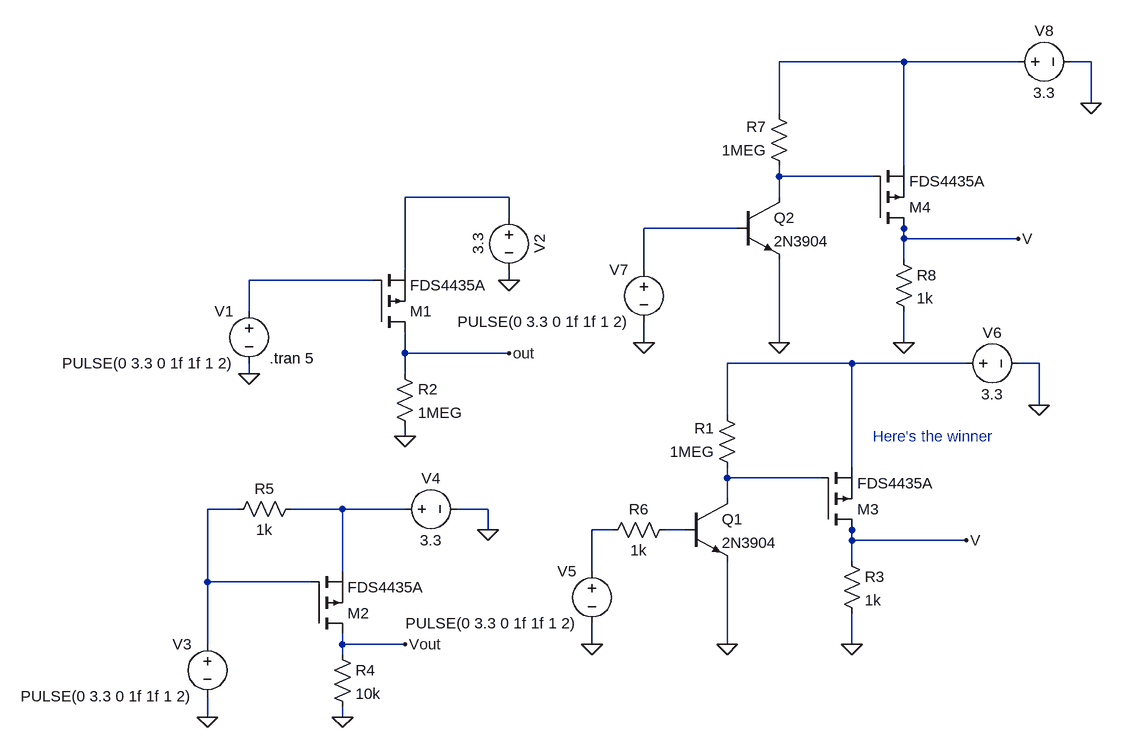
[diagram p0: schematic PMOS switch.asc]
PMOS switch.asc, the LTspice schematic file:
Version 4
SHEET 1 880 680
WIRE -256 -720 -448 -720
WIRE -80 -720 -256 -720
WIRE 32 -720 0 -720
WIRE 32 -656 32 -720
WIRE -448 -640 -448 -720
WIRE -256 -560 -256 -720
WIRE -448 -544 -448 -560
WIRE -304 -544 -448 -544
WIRE -864 -512 -1024 -512
WIRE -448 -512 -448 -544
WIRE -864 -480 -864 -512
WIRE -512 -464 -656 -464
WIRE -256 -464 -256 -480
WIRE -256 -448 -256 -464
WIRE -80 -448 -256 -448
WIRE -256 -416 -256 -448
WIRE -1024 -400 -1024 -512
WIRE -656 -400 -656 -464
WIRE -1072 -384 -1264 -384
WIRE -864 -384 -864 -400
WIRE -1264 -336 -1264 -384
WIRE -656 -288 -656 -320
WIRE -448 -288 -448 -416
WIRE -256 -288 -256 -336
WIRE -1024 -272 -1024 -304
WIRE -864 -272 -1024 -272
WIRE -336 -256 -528 -256
WIRE -160 -256 -336 -256
WIRE -48 -256 -80 -256
WIRE -1264 -240 -1264 -256
WIRE -1024 -240 -1024 -272
WIRE -48 -192 -48 -256
WIRE -528 -176 -528 -256
WIRE -1024 -144 -1024 -160
WIRE -336 -96 -336 -256
WIRE -528 -80 -528 -96
WIRE -384 -80 -528 -80
WIRE -528 -48 -528 -80
WIRE -1280 -32 -1328 -32
WIRE -1120 -32 -1200 -32
WIRE -1024 -32 -1120 -32
WIRE -896 -32 -944 -32
WIRE -896 0 -896 -32
WIRE -704 0 -736 0
WIRE -592 0 -624 0
WIRE -336 0 -336 -16
WIRE -336 16 -336 0
WIRE -160 16 -336 16
WIRE -336 48 -336 16
WIRE -1120 64 -1120 -32
WIRE -736 64 -736 0
WIRE -1328 80 -1328 -32
WIRE -1168 80 -1328 80
WIRE -1328 176 -1328 80
WIRE -1120 176 -1120 160
WIRE -1024 176 -1120 176
WIRE -736 176 -736 144
WIRE -528 176 -528 48
WIRE -336 176 -336 128
WIRE -1120 192 -1120 176
WIRE -1328 288 -1328 256
WIRE -1120 288 -1120 272
FLAG -1264 -240 0
FLAG -1024 -144 0
FLAG -864 -384 0
FLAG -864 -272 out
FLAG -1328 288 0
FLAG -1120 288 0
FLAG -896 0 0
FLAG -1024 176 Vout
FLAG -736 176 0
FLAG -528 176 0
FLAG -336 176 0
FLAG -48 -192 0
FLAG -160 16 V
FLAG -656 -288 0
FLAG -448 -288 0
FLAG -256 -288 0
FLAG 32 -656 0
FLAG -80 -448 V
SYMBOL voltage -1264 -352 M0
WINDOW 123 0 0 Left 2
WINDOW 39 0 0 Left 2
SYMATTR InstName V1
SYMATTR Value PULSE(0 3.3 0 1f 1f 1 2)
SYMBOL voltage -864 -496 R0
WINDOW 0 32 56 VTop 2
WINDOW 3 -32 56 VBottom 2
WINDOW 123 0 0 Left 2
WINDOW 39 0 0 Left 2
SYMATTR InstName V2
SYMATTR Value 3.3
SYMBOL res -1040 -256 R0
SYMATTR InstName R2
SYMATTR Value 1MEG
SYMBOL pmos -1072 -304 M180
SYMATTR InstName M1
SYMATTR Value FDS4435A
SYMBOL voltage -1328 160 M0
WINDOW 123 0 0 Left 2
WINDOW 39 0 0 Left 2
SYMATTR InstName V3
SYMATTR Value PULSE(0 3.3 0 1f 1f 1 2)
SYMBOL pmos -1168 160 M180
SYMATTR InstName M2
SYMATTR Value FDS4435A
SYMBOL voltage -1040 -32 R270
WINDOW 0 32 56 VTop 2
WINDOW 3 -32 56 VBottom 2
WINDOW 123 0 0 Left 2
WINDOW 39 0 0 Left 2
SYMATTR InstName V4
SYMATTR Value 3.3
SYMBOL res -1136 176 R0
SYMATTR InstName R4
SYMATTR Value 10k
SYMBOL res -1296 -16 R270
WINDOW 0 32 56 VTop 2
WINDOW 3 0 56 VBottom 2
SYMATTR InstName R5
SYMATTR Value 1k
SYMBOL voltage -736 48 M0
WINDOW 123 0 0 Left 2
WINDOW 39 0 0 Left 2
SYMATTR InstName V5
SYMATTR Value PULSE(0 3.3 0 1f 1f 1 2)
SYMBOL voltage -176 -256 R270
WINDOW 0 32 56 VTop 2
WINDOW 3 -32 56 VBottom 2
WINDOW 123 0 0 Left 2
WINDOW 39 0 0 Left 2
SYMATTR InstName V6
SYMATTR Value 3.3
SYMBOL npn -592 -48 R0
SYMATTR InstName Q1
SYMATTR Value 2N3904
SYMBOL pmos -384 0 M180
SYMATTR InstName M3
SYMATTR Value FDS4435A
SYMBOL res -512 -80 R180
WINDOW 0 36 76 Left 2
WINDOW 3 36 40 Left 2
SYMATTR InstName R1
SYMATTR Value 1MEG
SYMBOL res -352 32 R0
SYMATTR InstName R3
SYMATTR Value 1k
SYMBOL res -720 16 R270
WINDOW 0 32 56 VTop 2
WINDOW 3 0 56 VBottom 2
SYMATTR InstName R6
SYMATTR Value 1k
SYMBOL voltage -656 -416 M0
WINDOW 123 0 0 Left 2
WINDOW 39 0 0 Left 2
SYMATTR InstName V7
SYMATTR Value PULSE(0 3.3 0 1f 1f 1 2)
SYMBOL voltage -96 -720 R270
WINDOW 0 32 56 VTop 2
WINDOW 3 -32 56 VBottom 2
WINDOW 123 0 0 Left 2
WINDOW 39 0 0 Left 2
SYMATTR InstName V8
SYMATTR Value 3.3
SYMBOL npn -512 -512 R0
SYMATTR InstName Q2
SYMATTR Value 2N3904
SYMBOL pmos -304 -464 M180
SYMATTR InstName M4
SYMATTR Value FDS4435A
SYMBOL res -432 -544 R180
WINDOW 0 36 76 Left 2
WINDOW 3 36 40 Left 2
SYMATTR InstName R7
SYMATTR Value 1MEG
SYMBOL res -272 -432 R0
SYMATTR InstName R8
SYMATTR Value 1k
TEXT -1232 -264 Left 2 !.tran 5
TEXT -304 -144 Left 2 ;Here's the winner

The netlist it stands for:
* PMOS switch.asc
V1 N005 0 PULSE(0 3.3 0 1f 1f 1 2)
V2 N003 0 3.3
R2 out 0 1MEG
M1 out N005 N003 N003 FDS4435A
V3 N008 0 PULSE(0 3.3 0 1f 1f 1 2)
M2 Vout N008 N009 N009 FDS4435A
V4 N009 0 3.3
R4 Vout 0 10k
R5 N008 N009 1k
V5 N010 0 PULSE(0 3.3 0 1f 1f 1 2)
V6 N006 0 3.3
Q1 N007 N011 0 0 2N3904
M3 V N007 N006 N006 FDS4435A
R1 N007 N006 1MEG
R3 V 0 1k
R6 N010 N011 1k
V7 N004 0 PULSE(0 3.3 0 1f 1f 1 2)
V8 N001 0 3.3
Q2 N002 N004 0 0 2N3904
M4 V N002 N001 N001 FDS4435A
R7 N002 N001 1MEG
R8 V 0 1k
.model NPN NPN
.model PNP PNP
.lib standard.bjt
.model NMOS NMOS
.model PMOS PMOS
.lib standard.mos
.tran 5
* Here's the winner
.backanno
.end